# Altium project Guardian.PrjPcb
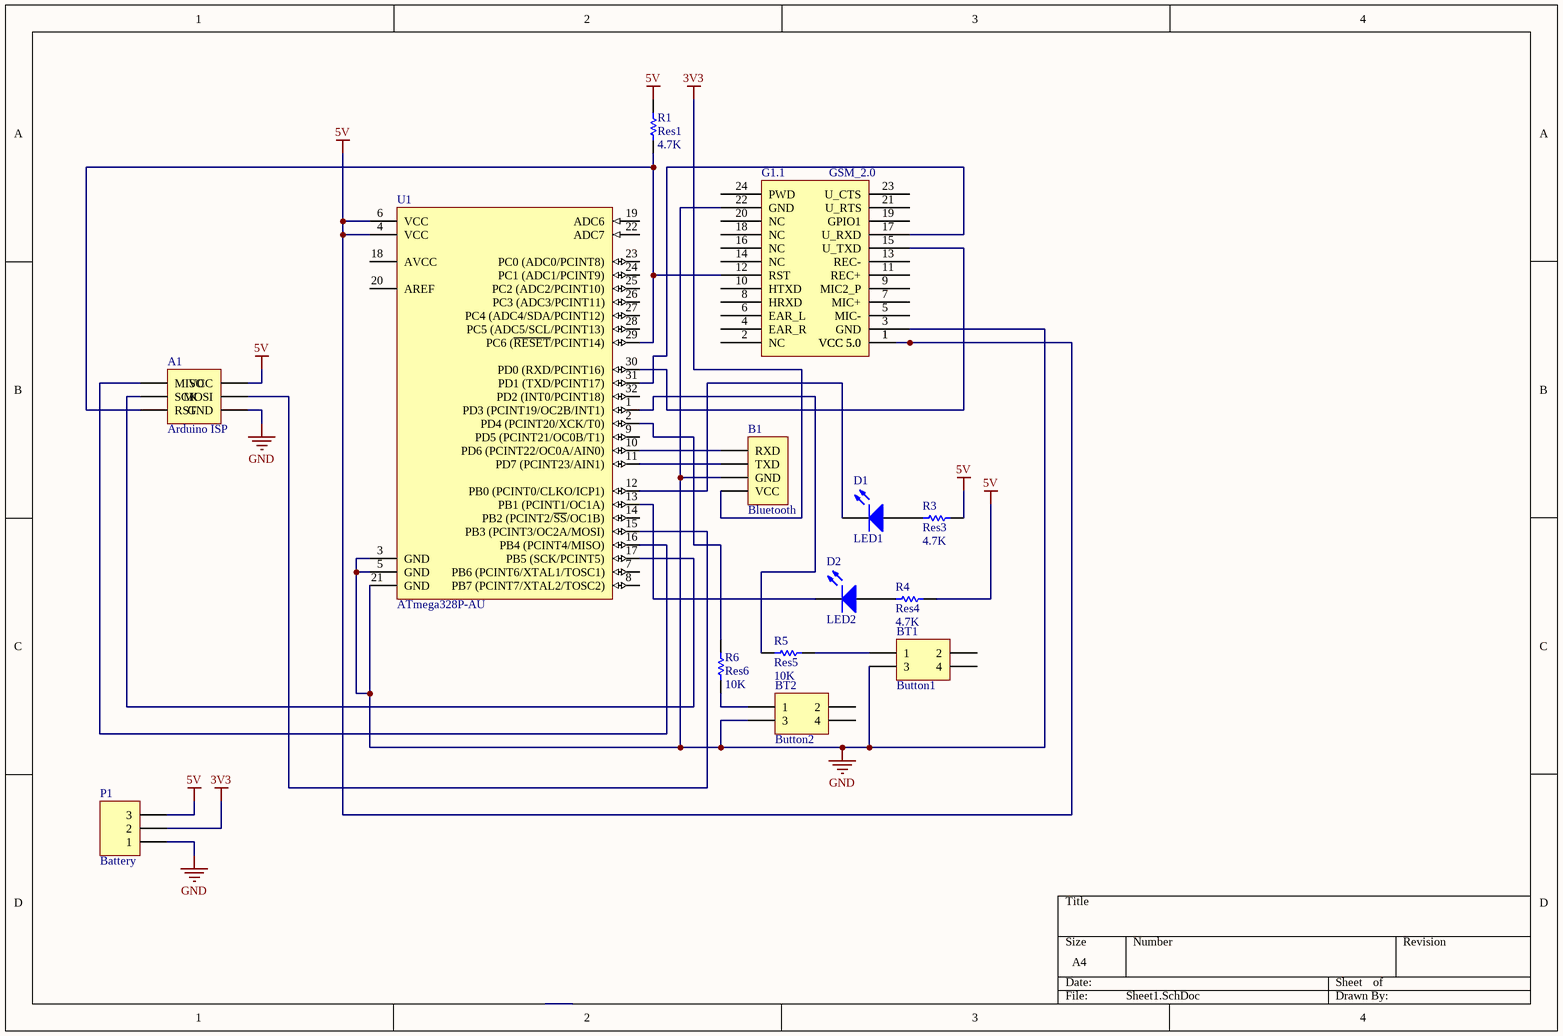
[diagram p0: Sheet1.SchDoc]
1 sheet, 14 parts. Net scope: global (net labels, ports and power ports of the same name join across sheets).
Board file: PCB.PcbDoc

## Sheet Sheet1.SchDoc
size A4

### Parts
A1  Arduino ISP  [HDR2X3H]
B1  Bluetooth  [HDR1X4]
BT1  Button1  [HDR2X2]
BT2  Button2  [HDR2X2]
D1  LED1  [LED-0]
D2  LED2  [LED-0]
G1.1  GSM_2.0  [DIP24]
P1  Battery  [HDR1X3]
R1  Res1  value 4.7K  [AXIAL-0.3]
R3  Res3  value 4.7K  [AXIAL-0.3]
R4  Res4  value 4.7K  [AXIAL-0.3]
R5  Res5  value 10K  [AXIAL-0.3]
R6  Res6  value 10K  [AXIAL-0.3]
U1  ATmega328P-AU  [32A_N]

### Nets
3V3: B1.4(VCC) P1.2
5V: A1.2(VCC) G1.1.1(VCC_5.0) P1.3 R1.2 R3.1 R4.1 U1.4(VCC) U1.6(VCC)
GND: A1.6(GND) B1.3(GND) BT1.3 BT2.3 G1.1.3(GND) G1.1.22(GND) P1.1 U1.3(GND) U1.5(GND) U1.21(GND)
NetA1_1: A1.1(MISO) U1.16(PB4_(PCINT4/MISO))
NetA1_3: A1.3(SCK) U1.17(PB5_(SCK/PCINT5))
NetA1_4: A1.4(MOSI) U1.15(PB3_(PCINT3/OC2A/MOSI))
NetA1_5: A1.5(RST) G1.1.12(RST) R1.1 U1.29(PC6_(~{RESET}/PCINT14))
NetB1_1: B1.1(RXD) U1.10(PD6_(PCINT22/OC0A/AIN0))
NetB1_2: B1.2(TXD) U1.11(PD7_(PCINT23/AIN1))
NetBT1_1: BT1.1 R5.1
NetBT2_1: BT2.1 R6.1
NetD1_1: D1.1(A) R3.2
NetD1_2: D1.2(K) U1.12(PB0_(PCINT0/CLKO/ICP1))
NetD2_1: D2.1(A) R4.2
NetD2_2: D2.2(K) U1.13(PB1_(PCINT1/OC1A))
NetG1.1_15: G1.1.15(U_TXD) U1.30(PD0_(RXD/PCINT16))
NetG1.1_17: G1.1.17(U_RXD) U1.31(PD1_(TXD/PCINT17))
NetR5_2: R5.2 U1.1(PD3_(PCINT19/OC2B/INT1))
NetR6_2: R6.2 U1.2(PD4_(PCINT20/XCK/T0))

Not connected (* = marked no-connect by the designer): BT1 2 4; BT2 2 4; G1.1 2(NC) 4(EAR_R) 5(MIC-) 6(EAR_L) 7(MIC+) 8(HRXD) 9(MIC2_P) 10(HTXD) 11(REC+) 13(REC-) 14(NC) 16(NC) 18(NC) 19(GPIO1) 20(NC) 21(U_RTS) 23(U_CTS) 24(PWD); U1 7(PB6_(PCINT6/XTAL1/TOSC1)) 8(PB7_(PCINT7/XTAL2/TOSC2)) 9(PD5_(PCINT21/OC0B/T1)) 14(PB2_(PCINT2/~{SS}/OC1B)) 18(AVCC) 19(ADC6) 20(AREF) 22(ADC7) 23(PC0_(ADC0/PCINT8)) 24(PC1_(ADC1/PCINT9)) 25(PC2_(ADC2/PCINT10)) 26(PC3_(ADC3/PCINT11)) 27(PC4_(ADC4/SDA/PCINT12)) 28(PC5_(ADC5/SCL/PCINT13)) 32(PD2_(INT0/PCINT18))

### Library data of the parts
A1 = Header 3X2H: Header, 3-Pin, Dual row, Right Angle; LatestRevisionDate: 17-Jul-2002; LatestRevisionNote: Re-released for DXP Platform.; Publisher: Altium Limited
B1 = Header 4: Header, 4-Pin; LatestRevisionDate: 17-Jul-2002; LatestRevisionNote: Re-released for DXP Platform.; Publisher: Altium Limited
BT1 BT2 = Header 2X2: Header, 2-Pin, Dual row; LatestRevisionDate: 17-Jul-2002; LatestRevisionNote: Re-released for DXP Platform.; Publisher: Altium Limited
D1 D2 = LED0: Typical INFRARED GaAs LED; Published: 8-Jun-2000; LatestRevisionDate: 08-Jul-2005; LatestRevisionNote: Mech Layer 1 removed.; PackageReference: LED-0; Publisher: Altium Limited; PackageDescription: LED; 2 Leads
G1.1 = Component_1
P1 = Header 3: Header, 3-Pin; LatestRevisionDate: 17-Jul-2002; LatestRevisionNote: Re-released for DXP Platform.; Publisher: Altium Limited
R1 R3-R6 = Res1: Resistor; Published: 8-Jun-2000; LatestRevisionDate: 17-Jul-2002; LatestRevisionNote: Re-released for DXP Platform.; PackageReference: AXIAL-0.3; Publisher: Altium Limited; PackageDescription: Axial Device, Thru-Hole; 2 Leads; 0.3 in Pin Spacing
U1 = ATmega328P-AU: 8-bit AVR Microcontroller, 32KB Flash, 1KB EEPROM, 2KB SRAM, 32-pin TQFP, Industrial Grade (-40°C to 85°C); Published: 1-Apr-2010; DatasheetVersion: revA, Jan-2010; PackageVersion: revB, Oct-2001; PackageReference: 32A; Publisher: Altium Limited; PackageDescription: 32-Lead, 7x7x1.0 mm Body, 0.8mm Lead Pitch, Thin Profile Plastic Quad Flat Package (TQFP); Supplier 1: Digi-Key; Supplier Part Number 1: ATMEGA328P-AU-ND; Supplier 2: Farnell; Supplier Part Number 2: 1715486; Supplier 3: Mouser; Supplier Part Number 3: 556-ATMEGA328P-AU; Code_JEDEC: MS-026-ABA; ComponentLink1Description: Manufacturer Link; ComponentLink1URL: http://www.atmel.com/products/avr/default.asp?; ComponentLink2Description: ATmega48A/48PA/88A/88PA/168A/168PA/328/328P Datasheet; ComponentLink2URL: http://www.atmel.com/dyn/resources/prod_documents/8271.pdf; ComponentLink3Description: ATmega48A/48PA/88A/88PA/168A/168PA/328/328P Summary; ComponentLink3URL: http://www.atmel.com/dyn/resources/prod_documents/8271S.pdf; ComponentLink4Description: Atmel.com Home; ComponentLink4URL: http://www.atmel.com